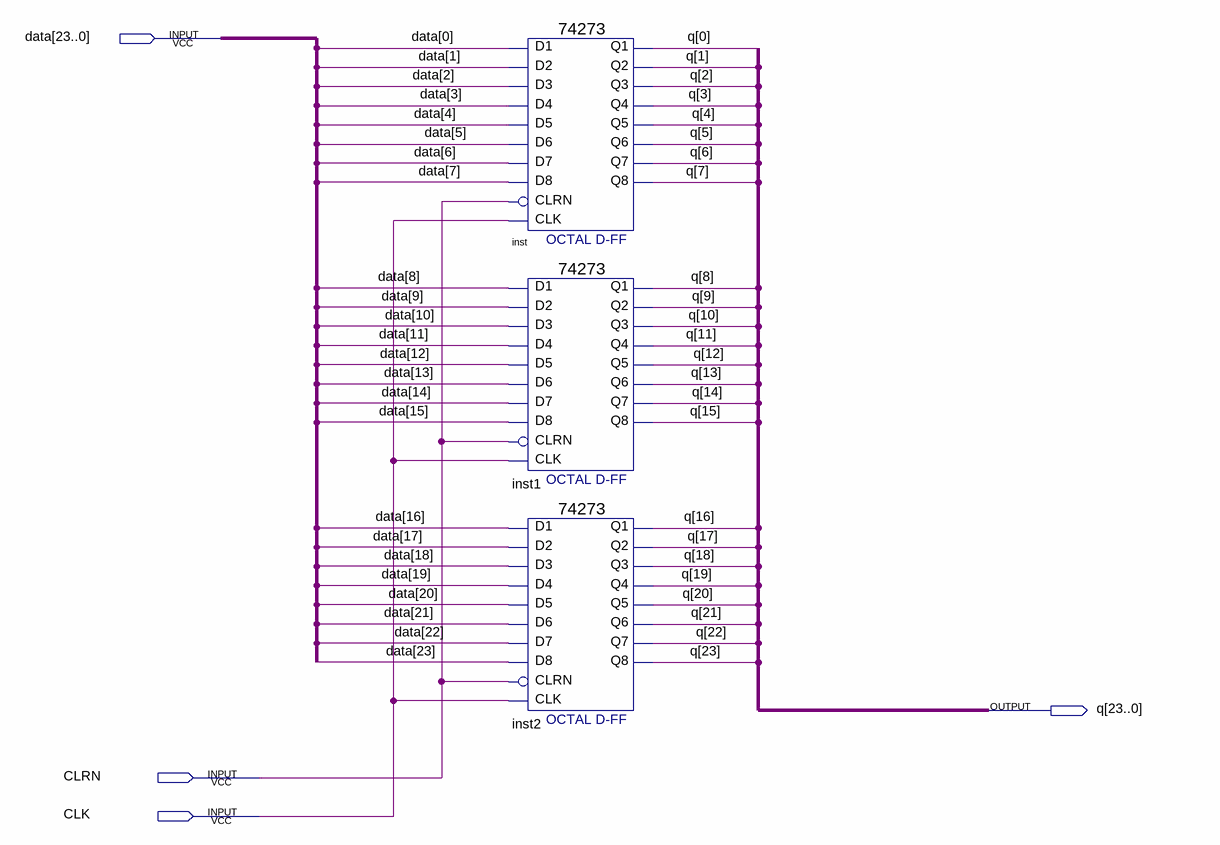
[diagram p0: schematic sheet]
// Quartus schematic uIR.bdf as structural Verilog: 3 symbols, 4 pins
module uIR (
  input  [23:0] data,
  input  CLRN,
  input  CLK,
  output [23:0] q
);

  \74273  inst (
    .D2(data[1]), .D3(data[2]), .D1(data[0]), .D4(data[3]), .D7(data[6]), .D6(data[5]), .D5(data[4]),
    .D8(data[7]), .CLK(CLK), .CLRN(CLRN), .Q4(q[3]), .Q1(q[0]), .Q2(q[1]), .Q3(q[2]), .Q6(q[5]), .Q5(q[4]),
    .Q7(q[6]), .Q8(q[7]));
  \74273  inst1 (
    .D2(data[9]), .D3(data[10]), .D1(data[8]), .D4(data[11]), .D7(data[14]), .D6(data[13]), .D5(data[12]),
    .D8(data[15]), .CLK(CLK), .CLRN(CLRN), .Q4(q[11]), .Q1(q[8]), .Q2(q[9]), .Q3(q[10]), .Q6(q[13]),
    .Q5(q[12]), .Q7(q[14]), .Q8(q[15]));
  \74273  inst2 (
    .D2(data[17]), .D3(data[18]), .D1(data[16]), .D4(data[19]), .D7(data[22]), .D6(data[21]), .D5(data[20]),
    .D8(data[23]), .CLK(CLK), .CLRN(CLRN), .Q4(q[19]), .Q1(q[16]), .Q2(q[17]), .Q3(q[18]), .Q6(q[21]),
    .Q5(q[20]), .Q7(q[22]), .Q8(q[23]));
endmodule
